# EAGLE schematic main_module (EAGLE 8.6.3)
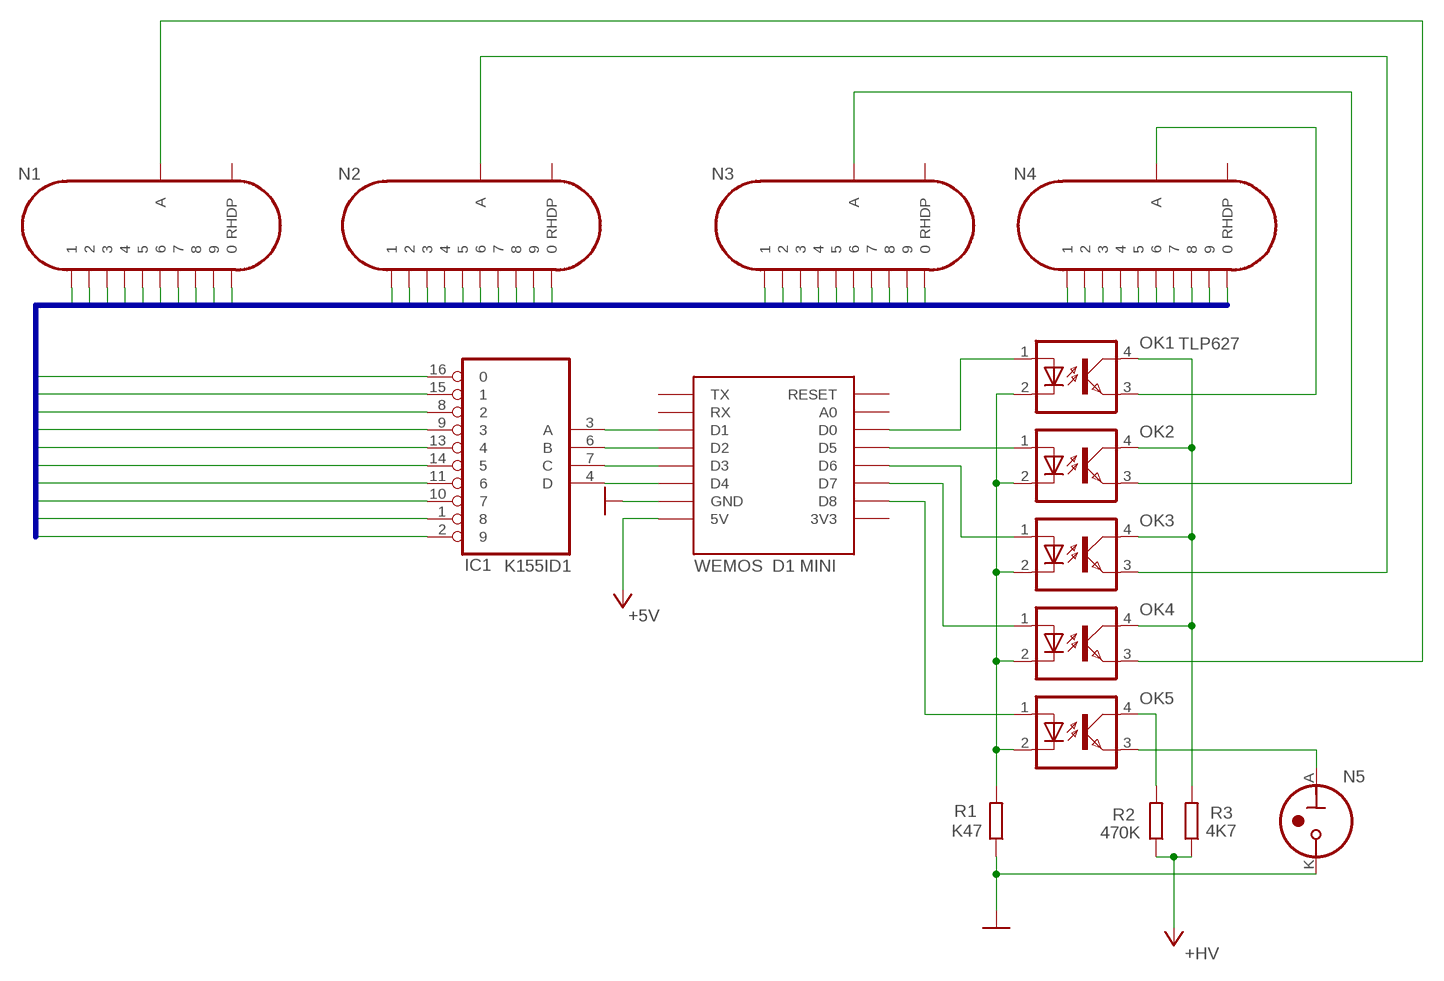
[diagram p0: schematic, sheet 1]

## Parts
IC1  K155ID1  74141N  [DIL16]
N1  IN-8-2  [IN-8-2]
N2  IN-8-2  [IN-8-2]
N3  IN-8-2  [IN-8-2]
N4  IN-8-2  [IN-8-2]
N5  IN-3  [IN-3]
OK1  TLP627  LTV816  [DIL04]
OK2  LTV816  [DIL04]
OK3  LTV816  [DIL04]
OK4  LTV816  [DIL04]
OK5  LTV816  [DIL04]
R1  K47  R-EU_0207/10  [0207/10]
R2  470K  R-EU_0207/10  [0207/10]
R3  4K7  R-EU_0207/10  [0207/10]
WEMOS  D1 MINI  WEMOS-D1-MINI  [WEMOS-D1-MINI]

## Nets
+5V: WEMOS.5V
GND: N5.K R1.1 WEMOS.GND
N0: IC1.16 N1.0 N2.0 N3.0 N4.0
N1: IC1.15 N1.1 N2.1 N3.1 N4.1
N2: IC1.8 N1.2 N2.2 N3.2 N4.2
N3: IC1.9 N1.3 N2.3 N3.3 N4.3
N4: IC1.13 N1.4 N2.4 N3.4 N4.4
N5: IC1.14 N1.5 N2.5 N3.5 N4.5
N6: IC1.11 N1.6 N2.6 N3.6 N4.6
N7: IC1.10 N1.7 N2.7 N3.7 N4.7
N8: IC1.1 N1.8 N1.9 N2.8 N3.8 N4.8
N9: IC1.2 N2.9 N3.9 N4.9
N$1: IC1.3(A) WEMOS.D1
N$2: IC1.6(B) WEMOS.D2
N$3: IC1.7(C) WEMOS.D3
N$4: IC1.4(D) WEMOS.D4
N$5: OK1.1(A) WEMOS.D0
N$6: OK2.1(A) WEMOS.D5
N$7: OK3.1(A) WEMOS.D6
N$8: OK4.1(A) WEMOS.D7
N$9: OK5.1(A) WEMOS.D8
N$10: OK1.2(C) OK2.2(C) OK3.2(C) OK4.2(C) OK5.2(C) R1.2
N$11: N4.A OK1.3(EMIT)
N$12: N3.A OK2.3(EMIT)
N$13: N2.A OK3.3(EMIT)
N$14: N1.A OK4.3(EMIT)
N$15: OK1.4(COL) OK2.4(COL) OK3.4(COL) OK4.4(COL) R3.2
N$16: OK5.4(COL) R2.2
N$17: N5.A OK5.3(EMIT)
VCC: R2.1 R3.1 ; supply symbol labelled +HV
Unconnected: N1..(RHDP) N2..(RHDP) N3..(RHDP) N4..(RHDP) WEMOS.3V3 WEMOS.A0 WEMOS.RESET WEMOS.RX WEMOS.TX

## Buses
N[0..9]

## Power pins joined to a net without a drawn wire
GND: IC1.12(GND)
VCC: IC1.5(VCC)

## Library data of the parts
IC1 = 74xx-eu:74*141: BCD to decimal DECODER/DRIVER
N1-N4 = russian-nixies:IN-8-2: IN-8-2: medium numeric frontview nixie tube
N5 = russian-nixies:IN-3: IN-3: nixie bulb
OK1-OK5 = optocoupler:LTV816: OPTO COUPLER Source: LITEON, LTV816.pdf; OC_FARNELL: unknown; OC_NEWARK: unknown
R1-R3 = rcl:R-EU_: RESISTOR, European symbol; SPICEPREFIX: R
WEMOS = esp8266modules:WEMOS-D1-MINI: WeMos.cc D1 mini ESP8266 module